# Altium project ESP12fDopplerRadar.PrjPcb
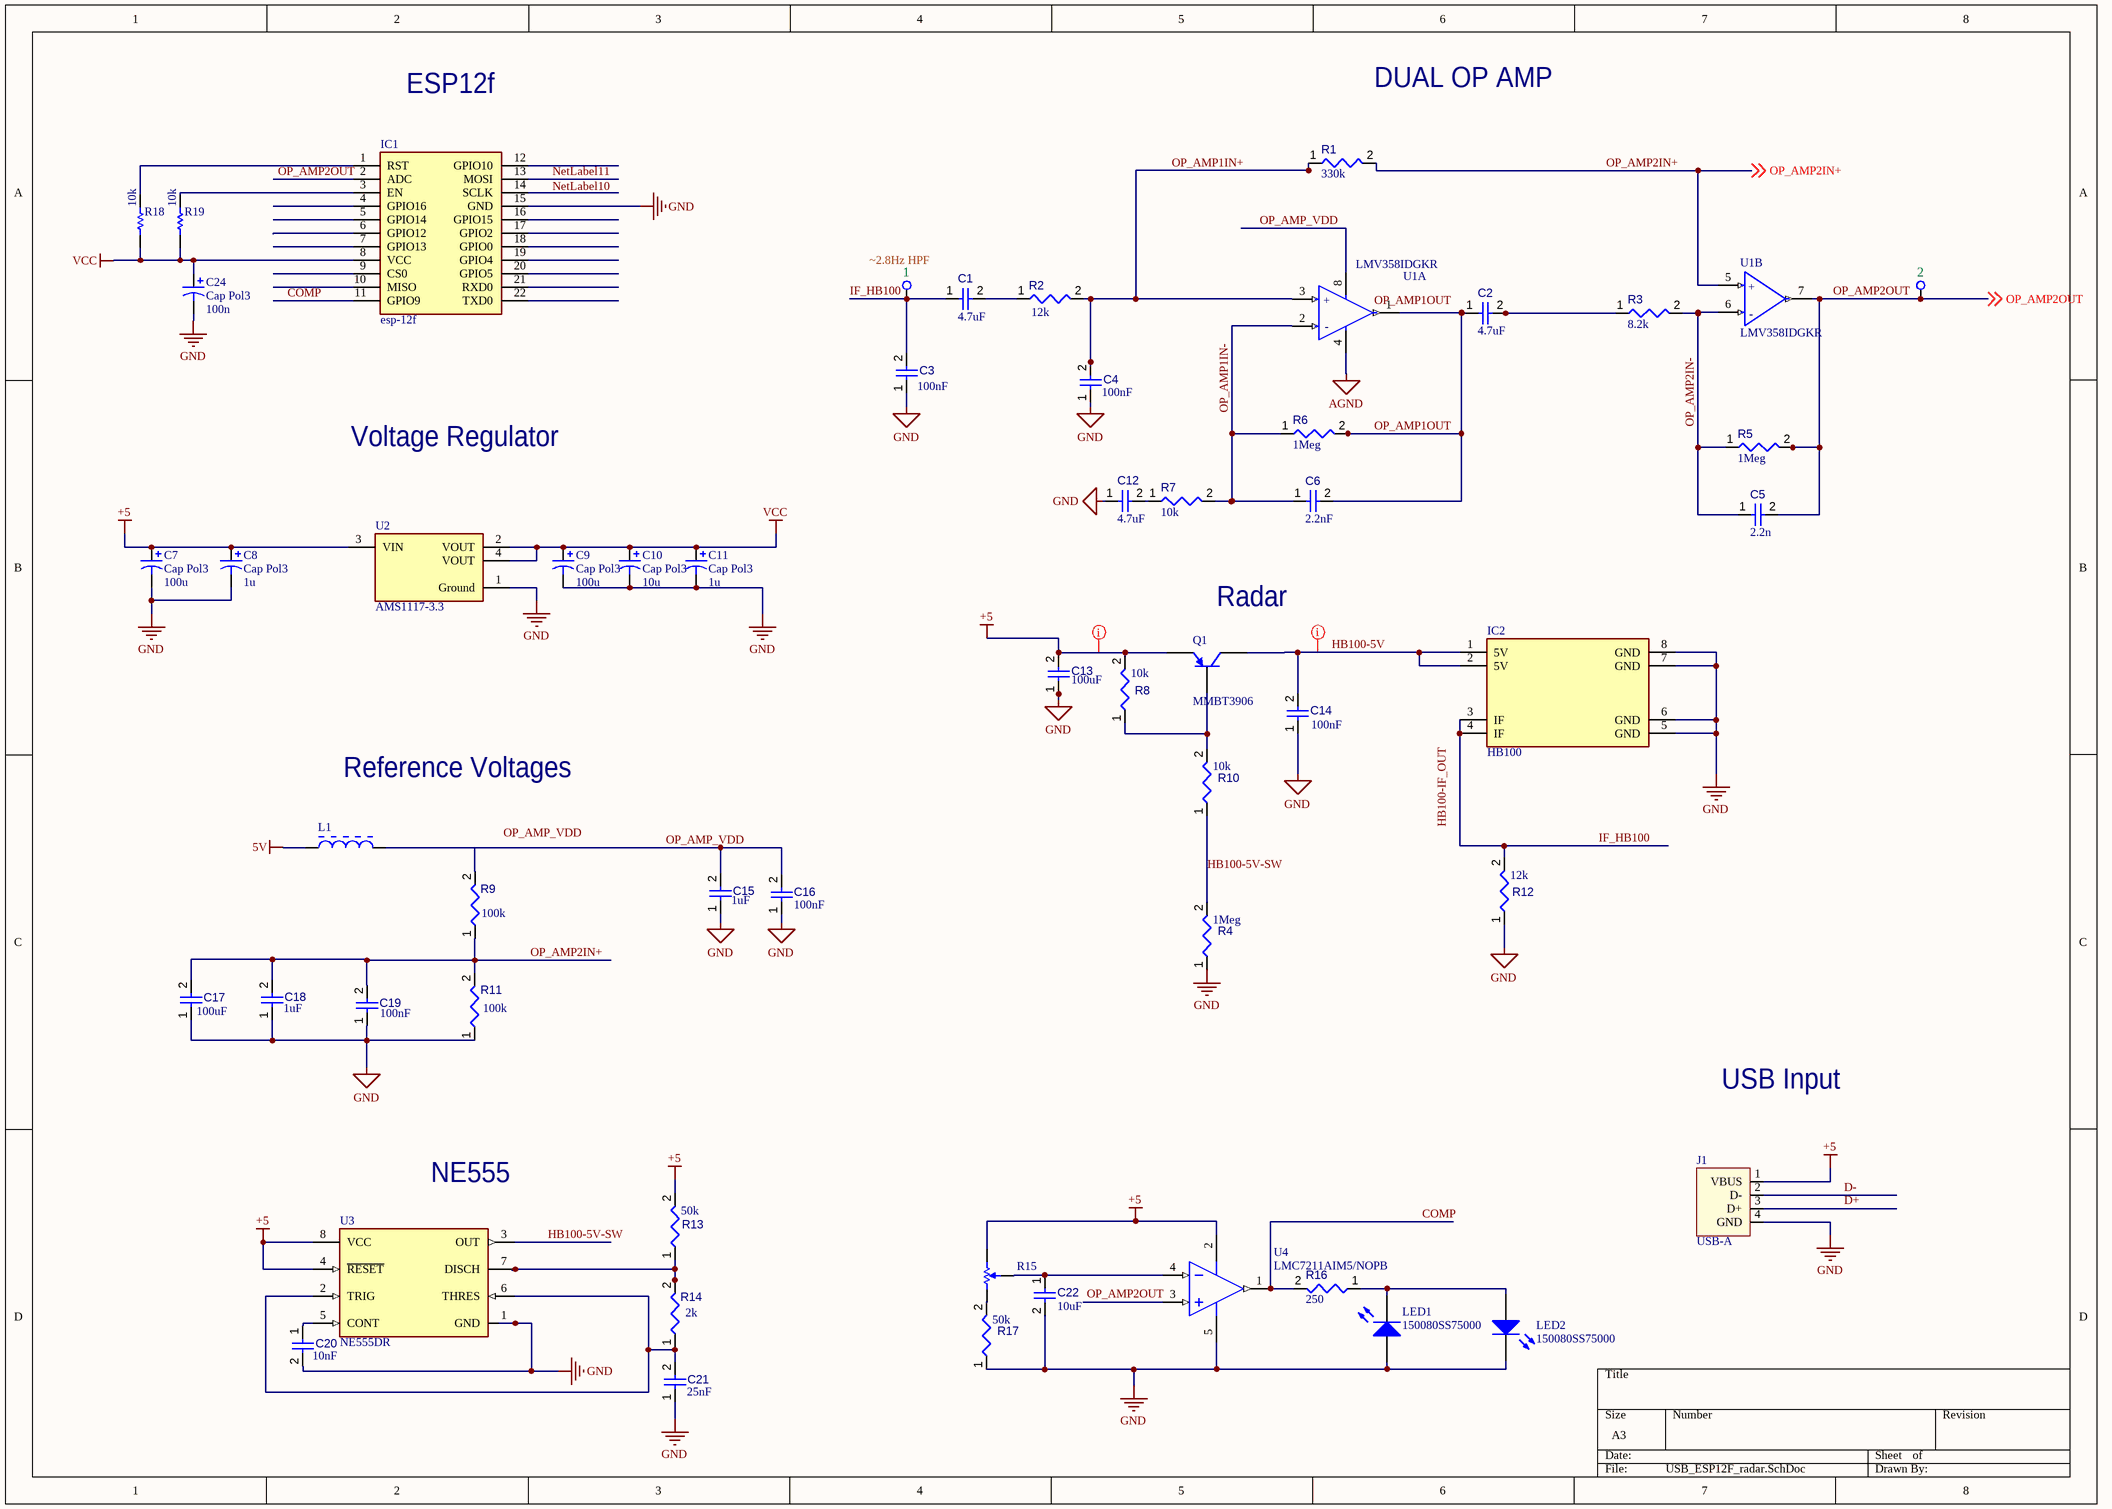
[diagram p0: USB_ESP12F_radar.SchDoc]
1 sheet, 55 parts. Net scope: global (net labels, ports and power ports of the same name join across sheets).
Board file: BlankUSB_radarESP12F.PcbDoc

## Sheet USB_ESP12F_radar.SchDoc
size A3; SheetNumber: 1; SheetTotal: 1

### Parts
1  TP  [TP_1.0MM]  (value not drawn)  (no BOM)
2  TP  [TP_1.0MM]  (value not drawn)  (no BOM)
C1  value 4.7uF  [CAPC0805(2012)145_L]
C2  value 4.7uF  [CAPC0805(2012)145_L]
C3  value 100nF  [CAPC0805(2012)145_L]
C4  value 100nF  [CAPC0805(2012)145_L]
C5  value 2.2n  [CAPC0805(2012)145_L]
C6  value 2.2nF  [CAPC0805(2012)145_L]
C7  Cap Pol3  value 100u  [C0805]
C8  Cap Pol3  value 1u  [C0805]
C9  Cap Pol3  value 100u  [C0805]
C10  Cap Pol3  value 10u  [C0805]
C11  Cap Pol3  value 1u  [C0805]
C12  value 4.7uF  [CAPC0805(2012)145_L]
C13  value 100uF  [CAPC0805(2012)145_L]
C14  value 100nF  [CAPC0805(2012)145_L]
C15  value 1uF  [CAPC0805(2012)145_L]
C16  value 100nF  [CAPC0805(2012)145_L]
C17  value 100uF  [CAPC0805(2012)145_L]
C18  value 1uF  [CAPC0805(2012)145_L]
C19  value 100nF  [CAPC0805(2012)145_L]
C20  value 10nF  [CAPC0805(2012)145_L]
C21  25nF  [CAPC0805(2012)145_L]
C22  value 10uF  [CAPC0805(2012)145_L]
C24  Cap Pol3  value 100n  [C0805]
IC1  esp-12f  [esp12f]
IC2  HB100  [HB100 - HOLE]
J1  USB-A  [USB-A-PCB]  (no BOM)
L1  BLM21PG331SN1D  [INDC2013X105X50ML20T20]  (value not drawn)
LED1  150080SS75000  [0805_A]
LED2  150080SS75000  [0805_A]
Q1  MMBT3906  [FAIR-SOT23-3_V]
R1  value 330k  [RESC2013X70X40ML20T20]
R2  value 12k  [RESC2013X70X40ML20T20]
R3  value 8.2k  [RESC2013X70X40ML20T20]
R4  value 1Meg  [RESC2013X70X40ML20T20]
R5  value 1Meg  [RESC2013X70X40ML20T20]
R6  value 1Meg  [RESC2013X70X40ML20T20]
R7  value 10k  [RESC2013X70X40ML20T20]
R8  value 10k  [RESC2013X70X40ML20T20]
R9  value 100k  [RESC2013X70X40ML20T20]
R10  value 10k  [RESC2013X70X40ML20T20]
R11  value 100k  [RESC2013X70X40ML20T20]
R12  value 12k  [RESC2013X70X40ML20T20]
R13  value 50k  [RESC2013X70X40ML20T20]
R14  value 2k  [RESC2013X70X40ML20T20]
R15  35WR10KLFTR  [BI-35WR10KLFTR-3_V]  (value not drawn)
R16  value 250  [RESC2013X70X40ML20T20]
R17  value 50k  [RESC2013X70X40ML20T20]
R18  10k  [RESC2013X58X38NL25T25]
R19  10k  [RESC2013X58X38NL25T25]
U1  LMV358IDGKR  [FP-DGK0008A-IPC_B]  (parts A,B of 2)
U2  AMS1117-3.3  [FP-AMS1117-IPC_C]
U3  NE555DR  [FP-D0008A-IPC_A]
U4  LMC7211AIM5/NOPB  [DBV0005A_M]

### Nets
5V: L1.1
+5: C7.1 C8.1 C13.2 J1.1(VBUS) Q1.2(E) R8.2 R13.2 R15.3 U2.3(VIN) U3.4(~{RESET}) U3.8(VCC) U4.2(V+)
AGND: U1.4(GND)
GND: C3.1 C4.1 C7.2 C8.2 C9.2 C10.2 C11.2 C12.1 C13.1 C14.1 C15.1 C16.1 C17.1 C18.1 C19.1 C20.2 C21.1 C22.2 C24.2 IC1.15(GND) IC2.5(GND) IC2.6(GND) IC2.7(GND) IC2.8(GND) J1.4(GND) LED1.2(A) LED2.1(K) R4.1 R11.1 R12.1 R17.1 U2.1(Ground) U3.1(GND) U4.5(V-)
VCC: C9.1 C10.1 C11.1 C24.1 IC1.8(VCC) R18.2 R19.2 U2.2(VOUT) U2.4(VOUT)
COMP: IC1.11(GPIO9) R16.2 U4.1(OUT)
D+: J1.3(D+)
D-: J1.2(D-)
HB100-5V: C14.2 IC2.1(5V) IC2.2(5V) Q1.3(C)
HB100-5V-SW: R4.2 R10.1 U3.3(OUT)
IF_HB100: 1.1 C1.1 C3.2 IC2.3(IF) IC2.4(IF) R12.2
NetLabel11: IC1.13(MOSI)
OP_AMP1IN+: C4.2 R1.1 R2.2 U1.3(1IN+)
OP_AMP1IN-: C6.1 R6.1 R7.2 U1.2(1IN-)
OP_AMP1OUT: C2.1 C6.2 R6.2 U1.1(1OUT)
OP_AMP2IN+: C17.2 C18.2 C19.2 R1.2 R9.1 R11.2 U1.5(2IN+) ; off-sheet OP_AMP2IN+
OP_AMP2IN-: C5.1 R3.2 R5.1 U1.6(2IN-)
OP_AMP2OUT: 2.1 C5.2 IC1.2(ADC) R5.2 U1.7(2OUT) U4.3(IN+) ; off-sheet OP_AMP2OUT
OP_AMP_VDD: C15.2 C16.2 L1.2 R9.2 U1.8(VCC+)
NetC1_2: C1.2 R2.1
NetC2_2: C2.2 R3.1
NetC12_2: C12.2 R7.1
NetC20_1: C20.1 U3.5(CONT)
NetC21_2: C21.2 R14.1 U3.2(TRIG) U3.6(THRES)
NetC22_1: C22.1 R15.2 U4.4(IN-)
NetIC1_1: IC1.1(RST) R18.1
NetIC1_3: IC1.3(EN) R19.1
NetLED1_1: LED1.1(K) LED2.2(A) R16.1
NetQ1_1: Q1.1(B) R8.1 R10.2
NetR13_1: R13.1 R14.2 U3.7(DISCH)
NetR15_1: R15.1 R17.2

Not connected (* = marked no-connect by the designer): IC1 4(GPIO16) 5(GPIO14) 6(GPIO12) 7(GPIO13) 9(CS0) 10(MISO) 12(GPIO10) 14(SCLK) 16(GPIO15) 17(GPIO2) 18(GPIO0) 19(GPIO4) 20(GPIO5) 21(RXD0) 22(TXD0)

### Layout directives
net class POWER: +5, HB100-5V

### Notes on the sheet
- ESP12f
- DUAL OP AMP
- (near 1) ~2.8Hz HPF
- Voltage Regulator
- (near Q1) Radar
- Reference Voltages
- USB Input
- (near U3) NE555
- Labels drawn without touching a wire or pin: HB100-IF_OUT, NetLabel10, OP_AMP1OUT, OP_AMP_VDD
- (in symbol CMP-2100-03651-2, part A) +; -
- (in symbol CMP-2100-03651-2, part B) +; -

### Library data of the parts
1 2 = KT-TP-0001: Test Point; Part Number: WDTL01350; Manufacturer: Na; SMT/TH: SMT; UL Critical: False; Value: TP; Manufacturer PN: Na; Package Name: Na; Part Type: Connector; Part Sub Type: Test Point
C1-C6 C12-C22 = CMP-001-00054-3: Tolerance: 10%; Voltage Rating: 6.3V; Pins: 2; Mounting Technology: SMT; Case/Package: 0805; Min Operating Temperature: -55°C; Max Operating Temperature: 85°C
  C21: Value: 25nF
C7-C11 C24 = Cap Pol3: Polarized Capacitor (Surface Mount); Published: 8-Jun-2000; LatestRevisionDate: 29-May-2009; LatestRevisionNote: IPC-7351 Footprint Added.; PackageReference: C0805; Publisher: Altium Limited; PackageDescription: Chip Capacitor
IC1 = esp-12f: Integrated Circuit; Manufacturer_Name: Ai-Thinker; Datasheet Link: https://docs.ai-thinker.com/_media/esp8266/docs/esp-12f_product_specification_en.pdf; Height: 3.1mm; Manufacturer_Part_Number: esp-12f
IC2 = KT-IC-0006: HB100 Doppler Radar; Manufacturer 1: AgilSense; Manufacturer Part Number 1: HB100
J1 = USB-A-PCB: USB-A PCB footprint; Artikkelnr Noca: N.A.; Part Number: USB-A-PCB; Manufacturer: *; Manufacturer Part Number: *; LatestRevisionDate: 2014-06-04; Pin Count: 4; Publisher: Nordic Semiconductor; Published: 2014-06-04; Value: USB-A; Note: *; Footprint Doc: USB-A-PCB; ComponentLink1Description: Datasheet; ComponentLink1URL: *; ComponentLink2Description: Supplier link; ComponentLink2URL: *; HelpURL: *; Part number IPS: N.A.; Supplier 1: *; Supplier Part Number 1: *; Supplier 2: *; Supplier Part Number 2: *
L1 = CMP-006-00000-3: IND, Chip Ferrite Bead, 330 Ohm, +/- 25%, 1.5 A, -55 to 125 degC, 0805 (2012 Metric), Tape and Reel; Manufacturer: Murata; Current Rating: 1.5A; Impedance: 330Ohm; Resistance: 90mohm; Max Operating Temperature: 125°C; Core Material: Ferrite; Case/Package: 0805; Mounting Technology: SM; Datasheet URL: http://psearch.en.murata.com/inductor/product/LQG15HS15NJ02_.pdf; Packaging: TapeandReel; Min Operating Temperature: -55°C; RoHS Compliant: True; Max Current Rating: 1.5A; Datasheet Version: Nov-11; Package Quantity: 4000; Package Reference: 0805; Package Description: 2-Pin Surface Mount Device, Body 2 x1.25 mm; Tolerance: 25%
LED1 LED2 = CMP-1426-00010-1: SMD mono-color Chip LED, WL-SMCW, Super Red; Manufacturer: Wuerth Elektronik; PackageReference: 0805_A; ComponentLink2URL: http://katalog.we-online.com/led/datasheet/150080SS75000.pdf; ComponentLink1URL: http://www.we-online.com; Color: Super Red; ComponentLink2Description: Datasheet; ComponentLink1Description: Manufacturer URL; PartNumber: 150080SS75000
Q1 = CMP-013-00008-2: PNP General-Purpose Amplifier, 40 V, 0.2 A, -55 to 150 degC, 3-Pin SOT23, RoHS, Tape and Reel; Manufacturer: Fairchild; hFE Min: 100; Package Version: Rev. 12, 03/2016; Power: 350mW; Vce Max: 400mV; Frequency: 250MHz; Elements: 1; Min Operating Temperature: -55°C; Package Reference: SOT23-3; Package Description: 3-Pin Small Outline Transistor, Body 2.92 x 1.325 mm, Pitch 0.95 mm; Datasheet URL: https://www.fairchildsemi.com/datasheets/MM/MMBT3906.pdf; Datasheet Version: Rev. 1.2.2, 04/2014; RoHS Compliant: True; Package Quantity: 3000; Case/Package: TO-236-3; Pins: 3; Mounting Technology: SM; Packaging: TapeandReel; Max Operating Temperature: 150°C
R1-R14 R16 R17 = CMP-009-00024-4: Power: 125mW; Voltage Rating: 150V; Tolerance: 1%; Case/Package: 0805; Pins: 2; RoHS Compliant: True; Mounting Technology: SM; Max Operating Temperature: 155°C; Min Operating Temperature: -55°C
R15 = CMP-009-00041-1: 3 mm Single-Turn Open Frame Surface Mount Cermet Trimming Potentiometer, +/- 25%, 35 W, -40 to 125 degC, 3-Pin SMD, RoHS, Tape and Reel; Manufacturer: BI Technologies; Power: 100mW; Voltage Rating: 50V; Resistance: 10k; Datasheet Version: Feb-10; Min Operating Temperature: -40°C; Package Description: 3-Pin Surface Mount Device, Body 3 x 3.1 mm; RoHS Compliant: True; Package Quantity: 2000; Case/Package: 35WR10KLFTR; Tolerance: 25%; Datasheet URL: http://www.bitechnologies.com/pdfs/35.pdf; Max Operating Temperature: 125°C; Manufacturer URL: http://www.bi-technologies.net/; Composition: Potentiometer; Package Reference: 35WR10KLFTR; Mounting Technology: SM; Packaging: TapeandReel
R18 R19 = CMP-2001-04325-1: Part Number: WSLP0805R0400FEA; Manufacturer: Vishay Dale
U1 = CMP-2100-03651-2: IC OPAMP GP 2 CIRCUIT 8VSSOP; Operating Supply Current: 210uA; Number of Channels: 2; Common Mode Rejection Ratio: 50dB; Input Offset Voltage (Vos): 7mV; Slew Rate: 1V/µs; Output Current: 160mA; Nominal Supply Current: 440uA; Voltage Gain: 100dB; Input Bias Current: 250nA; Gain Bandwidth Product: 1MHz; Min Supply Voltage: 2.7V; Max Supply Voltage: 5.5V; Mount: Surface Mount; Packaging: Tape and Reel; Length: 3mm; Package Quantity: 1; Min Operating Temperature: -40°C; Width: 3mm; Height: 0.97mm; Max Operating Temperature: 125°C; REACH SVHC: No SVHC; Radiation Hardening: No; Power Supply Rejection Ratio (PSRR): 50dB; Lead Free: Lead Free; Case/Package: MSOP; Contact Plating: Gold; Number of Circuits: 2; Unity Gain Bandwidth Product: 1MHz; Number of Pins: 8; Bandwidth: 1MHz; Output Current per Channel: 160mA; Number of Amplifiers: 2; Number of Elements: 2
U2 = CMP-209535-000001-1: LDO Voltage Regulators 1A, 3.3V; Manufacturer: Advanced Monolithic Systems; Dropout Voltage: 1.1V; Output Type: Fixed; Nominal Supply Current: 5mA; Max Power Dissipation: 1.2W; Max Supply Voltage: 15V; Number Of Outputs: 1; Standoff Height: 0.64mm; Max Junction Temp: +125°C; Height: 1.8mm; Package: AMS1117; Device Class L2: Power Management ICs; ComponentLink2Description: Datasheet; ComponentLink2URL: http://www.advanced-monolithic.com/pdf/ds1117.pdf; Category: IC; RoHS: TRUE; Automotive: No; Device Class L1: Integrated Circuits (ICs); Output Current: 1A; Device Class L3: Voltage Regulators - Linear; Temperature: -40°C to +125°C; Output Voltage: 3.3V; Manufacturer Part Number: AMS1117-3.3; Temperature Range Low: -40°C; Octopart: https://octopart.com/ams1117-3.3-advanced+monolithic+systems-25899300; Lead Free: Yes; Ipc Land Pattern Name: SOT229P700X180-4; Temperature Range High: +125°C
U3 = CMP-1685-00007-2: IC OSC SGL TIMER 100KHZ 8-SOIC; Low Level Output Current: 200mA; Quiescent Current: 15mA; Min Supply Voltage: 4.5V; Number of Timers/Counters: 1; Max Supply Voltage: 16V; Operating Supply Current: 10mA; High Level Output Current: -200mA; Packaging: Tape and Reel; Frequency: 100kHz; Weight: 0.002561oz; REACH SVHC: No SVHC; Package Quantity: 2500; Width: 3.91mm; Max Operating Temperature: 70°C; Contact Plating: Gold; Lead Free: Lead Free; Number of Pins: 8; Min Operating Temperature: 0°C; Radiation Hardening: No; Length: 4.9mm; Case/Package: SOIC; Height: 1.58mm; Mount: Surface Mount
U4 = CMP-0055-01212-3: Tiny CMOS Comparator with Rail-to-Rail Input, 5-pin SOT-23, Pb-Free; Manufacturer: Texas Instruments; CompType: Amplifiers; PowerWise: N; PackageTopMarking: C00A*XTT; ComponentLink1Description: Datasheet URL; RoHS: Y; Package Reference: DBV0005A; ComponentLink1URL: http://www.ti.com/general/docs/lit/getliterature.tsp?genericPartNumber=LMC7211-N&fileType=pdf; PackageDescription: Molded SOT-23, .115 x .063 x .040 in Body, 5 Lead, .0375 in Pitch; PinCount: 5